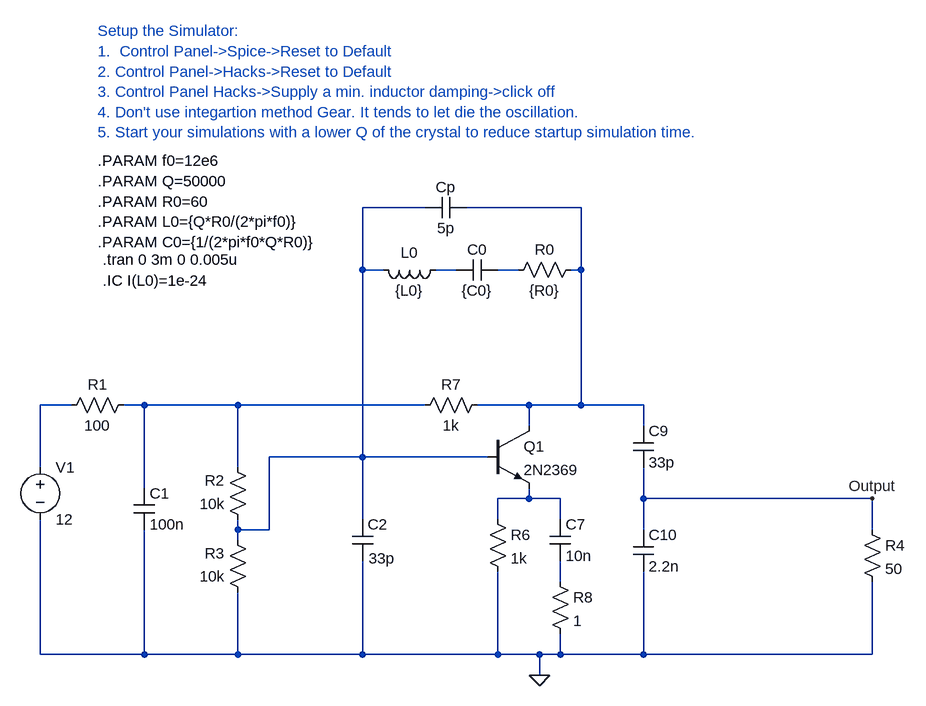
[diagram p0: schematic Pierce_12Mhz_r.asc]
Pierce_12Mhz_r.asc, the LTspice schematic file:
Version 4
SHEET 1 2020 1396
WIRE 640 1056 640 960
WIRE 640 1344 640 1136
WIRE 688 960 640 960
WIRE 800 960 768 960
WIRE 800 1088 800 960
WIRE 800 1344 640 1344
WIRE 800 1344 800 1152
WIRE 944 960 800 960
WIRE 944 1056 944 960
WIRE 944 1152 944 1136
WIRE 944 1168 944 1152
WIRE 944 1344 800 1344
WIRE 944 1344 944 1248
WIRE 992 1152 944 1152
WIRE 992 1152 992 1040
WIRE 1136 752 1136 656
WIRE 1136 1040 992 1040
WIRE 1136 1040 1136 752
WIRE 1136 1136 1136 1040
WIRE 1136 1344 944 1344
WIRE 1136 1344 1136 1200
WIRE 1168 752 1136 752
WIRE 1232 656 1136 656
WIRE 1232 960 944 960
WIRE 1280 752 1248 752
WIRE 1328 1040 1136 1040
WIRE 1344 1136 1344 1104
WIRE 1344 1344 1136 1344
WIRE 1344 1344 1344 1216
WIRE 1376 752 1344 752
WIRE 1392 960 1312 960
WIRE 1392 992 1392 960
WIRE 1392 1104 1344 1104
WIRE 1392 1104 1392 1088
WIRE 1408 1344 1344 1344
WIRE 1408 1376 1408 1344
WIRE 1440 1104 1392 1104
WIRE 1440 1136 1440 1104
WIRE 1440 1232 1440 1200
WIRE 1440 1344 1408 1344
WIRE 1440 1344 1440 1312
WIRE 1472 656 1296 656
WIRE 1472 752 1456 752
WIRE 1472 752 1472 656
WIRE 1472 960 1392 960
WIRE 1472 960 1472 752
WIRE 1568 960 1472 960
WIRE 1568 992 1568 960
WIRE 1568 1104 1568 1056
WIRE 1568 1152 1568 1104
WIRE 1568 1344 1440 1344
WIRE 1568 1344 1568 1216
WIRE 1920 1104 1568 1104
WIRE 1920 1152 1920 1104
WIRE 1920 1344 1568 1344
WIRE 1920 1344 1920 1232
FLAG 1408 1376 0
FLAG 1920 1104 Output
SYMBOL voltage 640 1040 R0
SYMATTR InstName V1
SYMATTR Value 12
SYMBOL res 784 944 R90
WINDOW 0 0 56 VBottom 0
WINDOW 3 32 56 VTop 0
SYMATTR InstName R1
SYMATTR Value 100
SYMBOL res 960 1152 R180
WINDOW 0 36 76 Left 0
WINDOW 3 36 40 Left 0
SYMATTR InstName R2
SYMATTR Value 10k
SYMBOL res 960 1264 R180
WINDOW 0 36 76 Left 0
WINDOW 3 36 40 Left 0
SYMATTR InstName R3
SYMATTR Value 10k
SYMBOL cap 784 1088 R0
SYMATTR InstName C1
SYMATTR Value 100n
SYMBOL cap 1120 1136 R0
WINDOW 3 25 60 Left 0
SYMATTR Value 33p
SYMATTR InstName C2
SYMBOL res 1904 1136 R0
SYMATTR InstName R4
SYMATTR Value 50
SYMBOL ind 1264 736 R90
WINDOW 0 5 56 VBottom 0
WINDOW 3 32 56 VTop 0
SYMATTR InstName L0
SYMATTR Value {L0}
SYMBOL cap 1344 736 R90
WINDOW 0 0 32 VBottom 0
WINDOW 3 32 32 VTop 0
SYMATTR InstName C0
SYMATTR Value {C0}
SYMBOL cap 1296 640 R90
WINDOW 0 0 32 VBottom 0
WINDOW 3 32 32 VTop 0
SYMATTR InstName Cp
SYMATTR Value 5p
SYMBOL res 1472 736 R90
WINDOW 0 0 56 VBottom 0
WINDOW 3 32 56 VTop 0
SYMATTR InstName R0
SYMATTR Value {R0}
SYMBOL cap 1424 1136 R0
SYMATTR InstName C7
SYMATTR Value 10n
SYMBOL res 1328 1120 R0
SYMATTR InstName R6
SYMATTR Value 1k
SYMBOL res 1216 976 R270
WINDOW 0 32 56 VTop 0
WINDOW 3 0 56 VBottom 0
SYMATTR InstName R7
SYMATTR Value 1k
SYMBOL cap 1552 992 R0
SYMATTR InstName C9
SYMATTR Value 33p
SYMBOL cap 1552 1152 R0
SYMATTR InstName C10
SYMATTR Value 2.2n
SYMBOL res 1424 1216 R0
SYMATTR InstName R8
SYMATTR Value 1
SYMBOL npn 1328 992 R0
SYMATTR InstName Q1
SYMATTR Value 2N2369
TEXT 736 736 Left 0 !.tran 0 3m 0 0.005u
TEXT 736 768 Left 0 !.IC I(L0)=1e-24
TEXT 728 384 Left 0 ;Setup the Simulator:\n1.  Control Panel->Spice->Reset to Default\n2. Control Panel->Hacks->Reset to Default\n3. Control Panel Hacks->Supply a min. inductor damping->click off\n4. Don't use integartion method Gear. It tends to let die the oscillation.\n5. Start your simulations with a lower Q of the crystal to reduce startup simulation time.
TEXT 728 584 Left 0 !.PARAM f0=12e6\n.PARAM Q=50000\n.PARAM R0=60\n.PARAM L0={Q*R0/(2*pi*f0)}\n.PARAM C0={1/(2*pi*f0*Q*R0)}

The netlist it stands for:
* Pierce_12Mhz_r.asc
V1 N001 0 12
R1 N002 N001 100
R2 N003 N002 10k
R3 0 N003 10k
C1 N002 0 100n
C2 N003 0 33p
R4 Output 0 50
L0 N004 N003 {L0}
C0 N006 N004 {C0}
Cp N007 N003 5p
R0 N007 N006 {R0}
C7 N005 N008 10n
R6 N005 0 1k
R7 N002 N007 1k
C9 N007 Output 33p
C10 Output 0 2.2n
R8 N008 0 1
Q1 N007 N003 N005 0 2N2369
.model NPN NPN
.model PNP PNP
.lib standard.bjt
.tran 0 3m 0 0.005u
.IC I(L0)=1e-24
* Setup the Simulator:
* 1.  Control Panel->Spice->Reset to Default
* 2. Control Panel->Hacks->Reset to Default
* 3. Control Panel Hacks->Supply a min. inductor damping->click off
* 4. Don't use integartion method Gear. It tends to let die the oscillation.
* 5. Start your simulations with a lower Q of the crystal to reduce startup simulation time.
.PARAM f0=12e6
.PARAM Q=50000
.PARAM R0=60
.PARAM L0={Q*R0/(2*pi*f0)}
.PARAM C0={1/(2*pi*f0*Q*R0)}
.backanno
.end